# Altium schematic sheet v0.SchDoc
size C
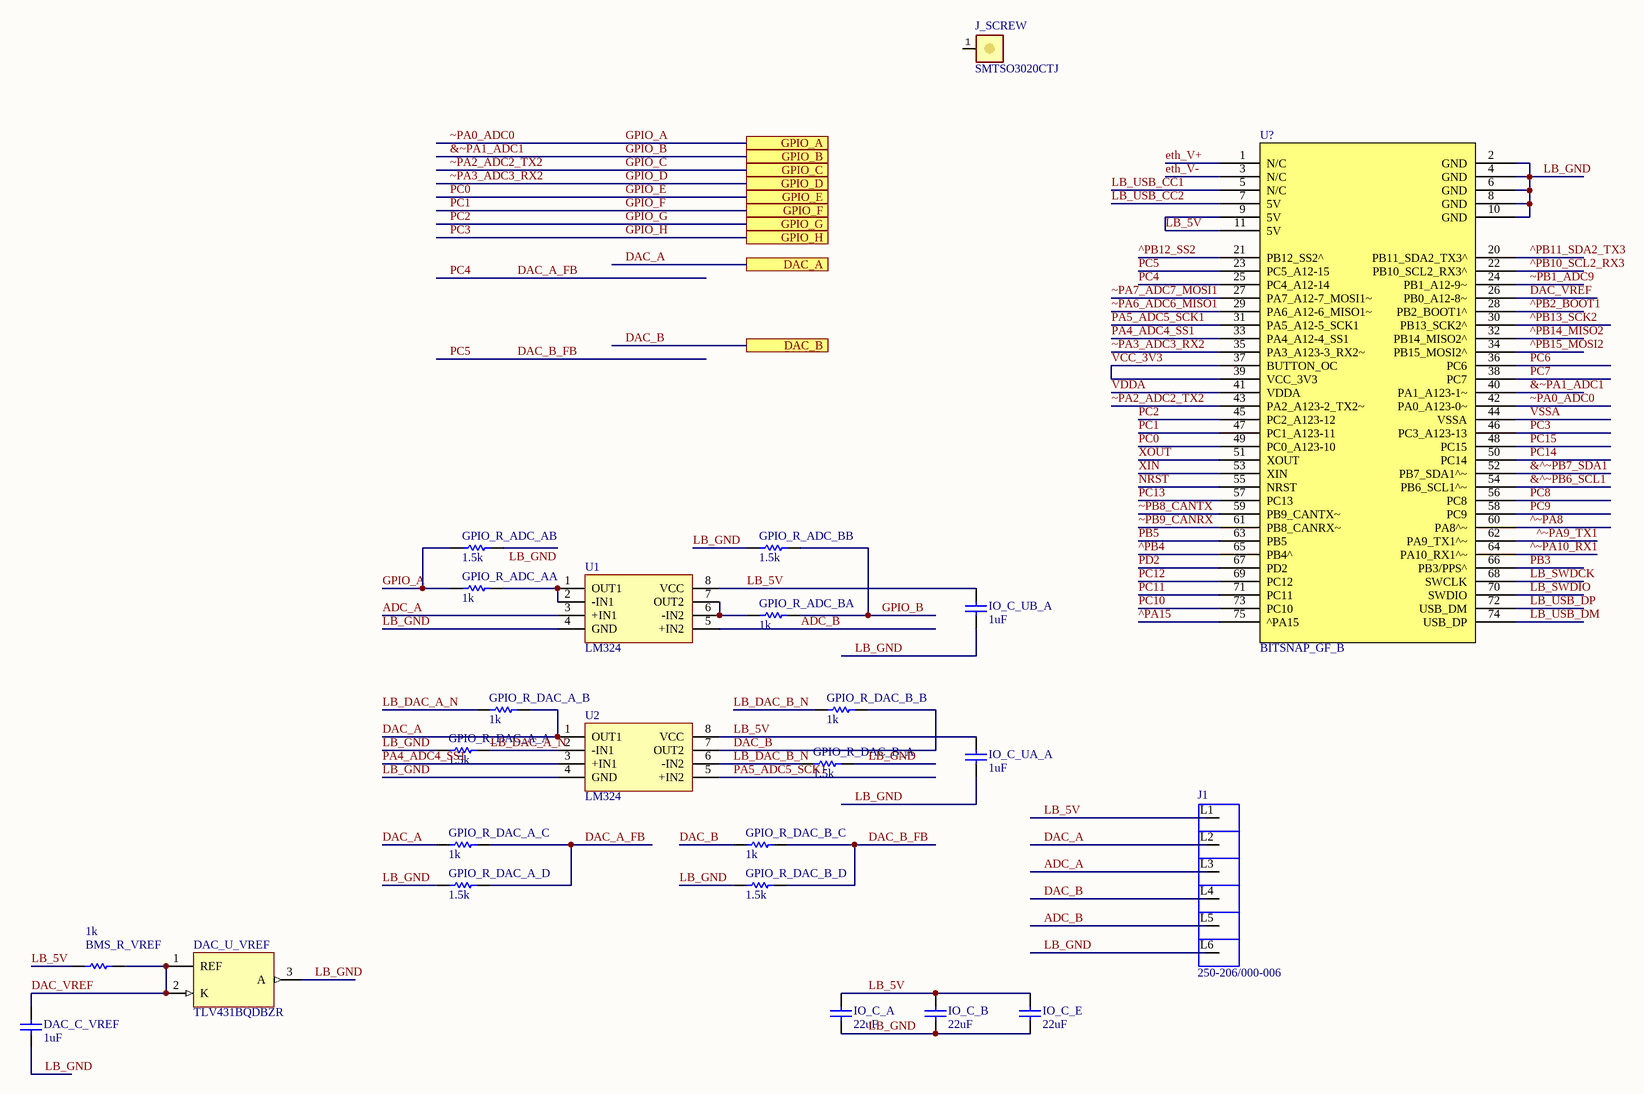
[diagram p0: v0.SchDoc]

## Parts
BMS_R_VREF  value 1k  [R_0402]  (hidden comment: 0402WGF1001TCE)
DAC_C_VREF  value 1uF  [C_0402]  (hidden comment: CL05A105KA5NQNC)
DAC_U_VREF  TLV431BQDBZR  [TO-236AB]
GPIO_R_ADC_AA  value 1k  [R_0402]  (hidden comment: 0402WGF1001TCE)
GPIO_R_ADC_AB  value 1.5k  [R_0402]  (hidden comment: 0402WGF1501TCE)
GPIO_R_ADC_BA  value 1k  [R_0402]  (hidden comment: 0402WGF1001TCE)
GPIO_R_ADC_BB  value 1.5k  [R_0402]  (hidden comment: 0402WGF1501TCE)
GPIO_R_DAC_A_A  value 1.5k  [R_0402]  (hidden comment: 0402WGF1501TCE)
GPIO_R_DAC_A_B  value 1k  [R_0402]  (hidden comment: 0402WGF1001TCE)
GPIO_R_DAC_A_C  value 1k  [R_0402]  (hidden comment: 0402WGF1001TCE)
GPIO_R_DAC_A_D  value 1.5k  [R_0402]  (hidden comment: 0402WGF1501TCE)
GPIO_R_DAC_B_A  value 1.5k  [R_0402]  (hidden comment: 0402WGF1501TCE)
GPIO_R_DAC_B_B  value 1k  [R_0402]  (hidden comment: 0402WGF1001TCE)
GPIO_R_DAC_B_C  value 1k  [R_0402]  (hidden comment: 0402WGF1001TCE)
GPIO_R_DAC_B_D  value 1.5k  [R_0402]  (hidden comment: 0402WGF1501TCE)
IO_C_A  value 22uF  [C_1206]  (hidden comment: CL31A226KAHNNNE)
IO_C_B  value 22uF  [C_1206]  (hidden comment: CL31A226KAHNNNE)
IO_C_E  value 22uF  [C_1206]  (hidden comment: CL31A226KAHNNNE)
IO_C_UA_A  value 1uF  [C_0402]  (hidden comment: CL05A105KA5NQNC)
IO_C_UB_A  value 1uF  [C_0402]  (hidden comment: CL05A105KA5NQNC)
J1  250-206/000-006  [P-250-206]
J_SCREW  SMTSO3020CTJ  [SMTSO3020CTJ]
U1  LM324  [SOIC-8-P1.27-W3.5]
U2  LM324  [SOIC-8-P1.27-W3.5]
U?  BITSNAP_GF_B  [POWERNET-USB]

## Ports
DAC_A, DAC_B, GPIO_A, GPIO_B, GPIO_C, GPIO_D, GPIO_E, GPIO_F, GPIO_G, GPIO_H

## Nets
&^~PB6_SCL1: U?.54(PB6_SCL1^~)
&^~PB7_SDA1: U?.52(PB7_SDA1^~)
&~PA1_ADC1: GPIO_R_ADC_BA.2 GPIO_R_ADC_BB.2 U?.40(PA1_A123-1~) ; port GPIO_B  [also labelled GPIO_B]
^PA15: U?.75(^PA15)
^PB2_BOOT1: U?.28(PB2_BOOT1^)
^PB4: U?.65(PB4^)
^PB10_SCL2_RX3: U?.22(PB10_SCL2_RX3^)
^PB11_SDA2_TX3: U?.20(PB11_SDA2_TX3^)
^PB12_SS2: U?.21(PB12_SS2^)
^PB13_SCK2: U?.30(PB13_SCK2^)
^PB14_MISO2: U?.32(PB14_MISO2^)
^PB15_MOSI2: U?.34(PB15_MOSI2^)
^~PA8: U?.60(PA8^~)
^~PA9_TX1: U?.62(PA9_TX1^~)
^~PA10_RX1: U?.64(PA10_RX1^~)
ADC_A: J1.L3(P3) U1.3(+IN1)
ADC_B: J1.L5(P5) U1.5(+IN2)
DAC_A: GPIO_R_DAC_A_B.2 GPIO_R_DAC_A_C.1 J1.L2(P2) U2.1(OUT1) ; port DAC_A
DAC_A_FB: GPIO_R_DAC_A_C.2 GPIO_R_DAC_A_D.2 U?.25(PC4_A12-14)  [also labelled PC4]
DAC_B: GPIO_R_DAC_B_B.2 GPIO_R_DAC_B_C.1 J1.L4(P4) U2.7(OUT2) ; port DAC_B
DAC_B_FB: GPIO_R_DAC_B_C.2 GPIO_R_DAC_B_D.2 U?.23(PC5_A12-15)  [also labelled PC5]
DAC_VREF: BMS_R_VREF.2 DAC_C_VREF.2 DAC_U_VREF.1(REF) DAC_U_VREF.2(K) U?.26(PB0_A12-8~)
eth_V+: U?.1(N/C)
eth_V-: U?.3(N/C)
GPIO_A: GPIO_R_ADC_AA.1 GPIO_R_ADC_AB.2 U?.42(PA0_A123-0~) ; port GPIO_A  [also labelled ~PA0_ADC0]
GPIO_C: U?.43(PA2_A123-2_TX2~) ; port GPIO_C  [also labelled ~PA2_ADC2_TX2]
GPIO_D: U?.35(PA3_A123-3_RX2~) ; port GPIO_D  [also labelled ~PA3_ADC3_RX2]
GPIO_E: U?.49(PC0_A123-10) ; port GPIO_E  [also labelled PC0]
GPIO_F: U?.47(PC1_A123-11) ; port GPIO_F  [also labelled PC1]
GPIO_G: U?.45(PC2_A123-12) ; port GPIO_G  [also labelled PC2]
GPIO_H: U?.46(PC3_A123-13) ; port GPIO_H  [also labelled PC3]
LB_5V: BMS_R_VREF.1 IO_C_A.2 IO_C_B.2 IO_C_E.2 IO_C_UA_A.2 IO_C_UB_A.2 J1.L1(P1) U1.8(VCC) U2.8(VCC) U?.9(5V) U?.11(5V)
LB_DAC_A_N: GPIO_R_DAC_A_A.2 GPIO_R_DAC_A_B.1 U2.2(-IN1)
LB_DAC_B_N: GPIO_R_DAC_B_A.2 GPIO_R_DAC_B_B.1 U2.6(-IN2)
LB_GND: DAC_C_VREF.1 DAC_U_VREF.3(A) GPIO_R_ADC_AB.1 GPIO_R_ADC_BB.1 GPIO_R_DAC_A_A.1 GPIO_R_DAC_A_D.1 GPIO_R_DAC_B_A.1 GPIO_R_DAC_B_D.1 IO_C_A.1 IO_C_B.1 IO_C_E.1 IO_C_UA_A.1 IO_C_UB_A.1 J1.L6(P6) U1.4(GND) U2.4(GND) U?.2(GND) U?.4(GND) U?.6(GND) U?.8(GND) U?.10(GND)
LB_SWDCK: U?.68(SWCLK)
LB_SWDIO: U?.70(SWDIO)
LB_USB_CC1: U?.5(N/C)
LB_USB_CC2: U?.7(5V)
LB_USB_DM: U?.74(USB_DP)
LB_USB_DP: U?.72(USB_DM)
NRST: U?.55(NRST)
PA4_ADC4_SS1: U2.3(+IN1) U?.33(PA4_A12-4_SS1)
PA5_ADC5_SCK1: U2.5(+IN2) U?.31(PA5_A12-5_SCK1)
PB3: U?.66(PB3/PPS^)
PB5: U?.63(PB5)
PC6: U?.36(PC6)
PC7: U?.38(PC7)
PC8: U?.56(PC8)
PC9: U?.58(PC9)
PC10: U?.73(PC10)
PC11: U?.71(PC11)
PC12: U?.69(PC12)
PC13: U?.57(PC13)
PC14: U?.50(PC14)
PC15: U?.48(PC15)
PD2: U?.67(PD2)
VCC_3V3: U?.37(BUTTON_OC) U?.39(VCC_3V3)
VDDA: U?.41(VDDA)
VSSA: U?.44(VSSA)
XIN: U?.53(XIN)
XOUT: U?.51(XOUT)
~PA6_ADC6_MISO1: U?.29(PA6_A12-6_MISO1~)
~PA7_ADC7_MOSI1: U?.27(PA7_A12-7_MOSI1~)
~PB1_ADC9: U?.24(PB1_A12-9~)
~PB8_CANTX: U?.59(PB9_CANTX~)
~PB9_CANRX: U?.61(PB8_CANRX~)
NetGPIO_R_ADC_AA_2: GPIO_R_ADC_AA.2 U1.1(OUT1) U1.2(-IN1)
NetGPIO_R_ADC_BA_1: GPIO_R_ADC_BA.1 U1.6(-IN2) U1.7(OUT2)

Not connected (* = marked no-connect by the designer): J_SCREW 1

## Library data of the parts
BMS_R_VREF GPIO_R_ADC_AA GPIO_R_ADC_BA GPIO_R_DAC_A_B GPIO_R_DAC_A_C GPIO_R_DAC_B_B GPIO_R_DAC_B_C = 0402WGF1001TCE: R - RESISTOR - SMD - 1k - 1% - 0402; LCSC Part #: C11702; JLC Availability: Basic
DAC_C_VREF IO_C_UA_A IO_C_UB_A = CL05A105KA5NQNC: C - CAPACITOR - MLCC - 1uF - 25V - 0402; WVDC: 16; LCSC Part #: C52923; JLC Availability: Basic
DAC_U_VREF = TLV431BQDBZR: U - IC - ADJUSTABLE SHUNT REGULATOR; VOut: ADJ; LCSC Part #: C398374; JLC Availability: Extended
GPIO_R_ADC_AB GPIO_R_ADC_BB GPIO_R_DAC_A_A GPIO_R_DAC_A_D GPIO_R_DAC_B_A GPIO_R_DAC_B_D = 0402WGF1501TCE: R - RESISTOR - SMD - 1.5k - 1% - 0402; LCSC Part #: C25867; JLC Availability: Basic
IO_C_A IO_C_B IO_C_E = CL31A226KAHNNNE: C - CAPACITOR - MLCC - 22uF - 25V - 1206; WVDC: 25V; LCSC Part #: C12891; JLC Availability: Basic
J1 = 250-206/000-006: J - 6 Position Wire to Board Terminal Block 45Â° (135Â°) Angle with Board 0.138 (3.50mm) Through Hole; MF: WAGO Innovative Connections; LCSC Part #: C2765065; Price: None; Check_prices: https://www.snapeda.com/parts/250-206/000-006/WAGO/view-part/?ref=eda; Value: *; SnapEDA_Link: https://www.snapeda.com/parts/250-206/000-006/WAGO/view-part/?ref=snap; MP: 250-206/000-006; Availability: In Stock; Purchase-URL: https://pricing.snapeda.com/search?q=250-206/000-006&ref=eda
J_SCREW = SMTSO3020CTJ: J - PCB NUT - M3 x 2; LCSC Part #: C2916381; JLC Availability: Extended
U1 U2 = LMV358IDR: U - IC - OP AMP (QUAD); Speed: 0.4V/us; LCSC Part #: C63813; JLC Availability: Extended
U? = POWERNET_USB: U - IC - Bitsnap CPU, NGFF B Key; Manufacturer: Foxconn; Manufacturer P/N: AS0BC21-S30BB-7H; LCSC Part #: C2761344